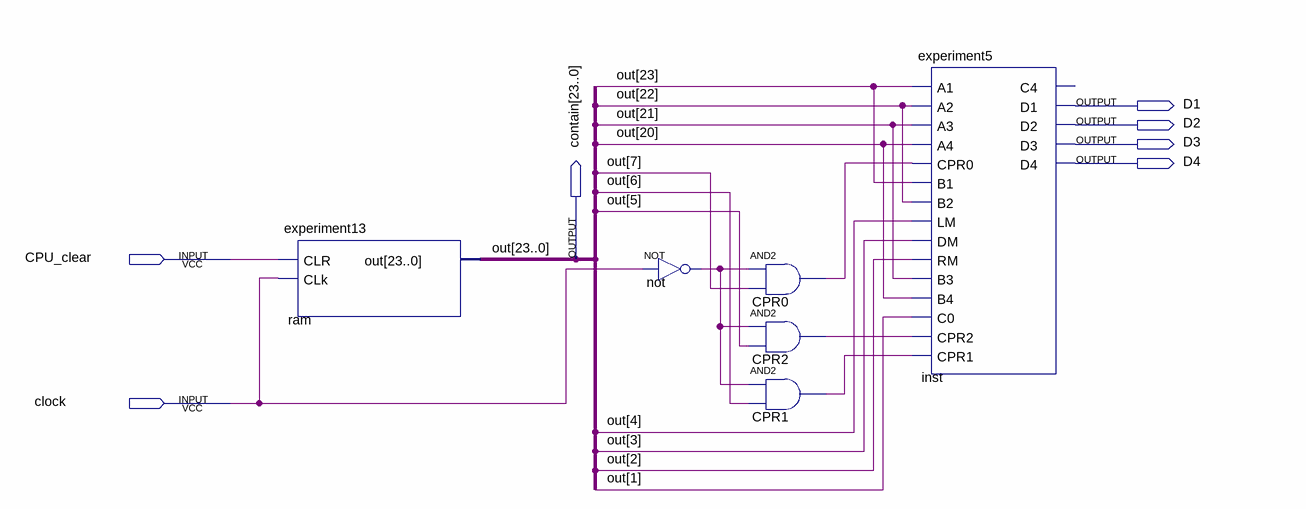
[diagram p0: schematic sheet]
// Quartus schematic experiment14.bdf as structural Verilog: 6 symbols, 7 pins
module experiment14 (
  input  CPU_clear,
  input  clock,
  output D1,
  output D2,
  output D3,
  output D4,
  output [23:0] contain
);

  wire CPR0_out, CPR1_out, CPR2_out, not_out;

  experiment13 ram (.CLR(CPU_clear), .CLk(clock), .out(contain));
  not \not  (not_out, clock);
  and CPR0 (CPR0_out, not_out, contain[7]);
  and CPR2 (CPR2_out, not_out, contain[5]);
  and CPR1 (CPR1_out, not_out, contain[6]);
  experiment5 inst (
    .A1(contain[23]), .A2(contain[22]), .A3(contain[21]), .A4(contain[20]), .CPR0(CPR0_out),
    .B1(contain[23]), .B2(contain[22]), .LM(contain[4]), .DM(contain[3]), .RM(contain[2]), .B3(contain[21]),
    .B4(contain[20]), .C0(contain[1]), .CPR2(CPR2_out), .CPR1(CPR1_out), .D1(D1), .D2(D2), .D3(D3), .D4(D4));  // open: C4

  // Other names for the same wires on the sheet: out[23:0] = contain
endmodule
